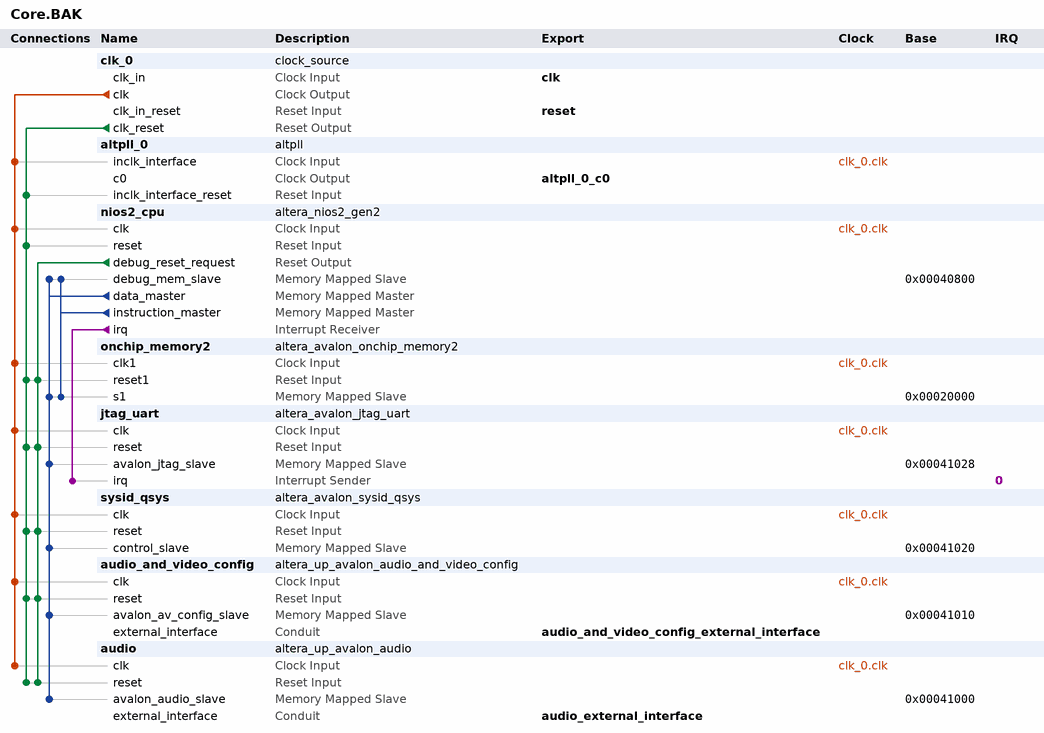
[diagram p0: system contents]
# Platform Designer (Qsys) system Core.BAK, Cyclone IV E EP4CE115F29C7
# Parameters at their usual value, and those the tool derives, are not listed.
package require -exact qsys 15.0
create_system Core.BAK
set_project_property DEVICE_FAMILY {Cyclone IV E}
set_project_property DEVICE EP4CE115F29C7

add_instance clk_0 clock_source 15.0
set_instance_parameter_value clk_0 clockFrequency 50000000

add_instance altpll_0 altpll 15.0
set_instance_parameter_value altpll_0 CLK0_DIVIDE_BY 25
set_instance_parameter_value altpll_0 CLK0_MULTIPLY_BY 6
set_instance_parameter_value altpll_0 INCLK0_INPUT_FREQUENCY 20000
set_instance_parameter_value altpll_0 PORT_ARESET PORT_USED
set_instance_parameter_value altpll_0 PORT_LOCKED PORT_USED
set_instance_parameter_value altpll_0 PORT_clk1 PORT_UNUSED
set_instance_parameter_value altpll_0 PORT_clk2 PORT_UNUSED
set_instance_parameter_value altpll_0 PORT_clk3 PORT_UNUSED

add_instance nios2_cpu altera_nios2_gen2 15.0
set_instance_parameter_value nios2_cpu dcache_size 2048
set_instance_parameter_value nios2_cpu exceptionSlave onchip_memory2.s1
set_instance_parameter_value nios2_cpu icache_size 4096
set_instance_parameter_value nios2_cpu impl Fast
set_instance_parameter_value nios2_cpu resetSlave onchip_memory2.s1

add_instance onchip_memory2 altera_avalon_onchip_memory2 15.0
set_instance_parameter_value onchip_memory2 dataWidth 32
set_instance_parameter_value onchip_memory2 dualPort false
set_instance_parameter_value onchip_memory2 initMemContent true
set_instance_parameter_value onchip_memory2 initializationFileName onchip_mem.hex
set_instance_parameter_value onchip_memory2 memorySize 102400

add_instance jtag_uart altera_avalon_jtag_uart 15.0
set_instance_parameter_value jtag_uart simInteractiveOptions NO_INTERACTIVE_WINDOWS

add_instance sysid_qsys altera_avalon_sysid_qsys 15.0
set_instance_parameter_value sysid_qsys id 0

add_instance audio_and_video_config altera_up_avalon_audio_and_video_config 15.0
set_instance_parameter_value audio_and_video_config audio_in {Microphone to ADC}
set_instance_parameter_value audio_and_video_config bit_length 16
set_instance_parameter_value audio_and_video_config board DE2-115
set_instance_parameter_value audio_and_video_config line_in_bypass true
set_instance_parameter_value audio_and_video_config mic_bypass true
set_instance_parameter_value audio_and_video_config sampling_rate {48 kHz}

add_instance audio altera_up_avalon_audio 15.0
set_instance_parameter_value audio audio_in true
set_instance_parameter_value audio avalon_bus_type {Memory Mapped}
set_instance_parameter_value audio dw 16

# connections
add_connection clk_0.clk altpll_0.inclk_interface clock
add_connection clk_0.clk audio.clk clock
add_connection clk_0.clk audio_and_video_config.clk clock
add_connection clk_0.clk jtag_uart.clk clock
add_connection clk_0.clk nios2_cpu.clk clock
add_connection clk_0.clk onchip_memory2.clk1 clock
add_connection clk_0.clk sysid_qsys.clk clock
add_connection clk_0.clk_reset altpll_0.inclk_interface_reset reset
add_connection clk_0.clk_reset audio.reset reset
add_connection clk_0.clk_reset audio_and_video_config.reset reset
add_connection clk_0.clk_reset jtag_uart.reset reset
add_connection clk_0.clk_reset nios2_cpu.reset reset
add_connection clk_0.clk_reset onchip_memory2.reset1 reset
add_connection clk_0.clk_reset sysid_qsys.reset reset
add_connection nios2_cpu.debug_reset_request audio.reset reset
add_connection nios2_cpu.debug_reset_request audio_and_video_config.reset reset
add_connection nios2_cpu.debug_reset_request jtag_uart.reset reset
add_connection nios2_cpu.debug_reset_request onchip_memory2.reset1 reset
add_connection nios2_cpu.debug_reset_request sysid_qsys.reset reset
add_connection nios2_cpu.data_master audio.avalon_audio_slave avalon
set_connection_parameter_value nios2_cpu.data_master/audio.avalon_audio_slave baseAddress 0x00041000
add_connection nios2_cpu.data_master audio_and_video_config.avalon_av_config_slave avalon
set_connection_parameter_value nios2_cpu.data_master/audio_and_video_config.avalon_av_config_slave baseAddress 0x00041010
add_connection nios2_cpu.data_master jtag_uart.avalon_jtag_slave avalon
set_connection_parameter_value nios2_cpu.data_master/jtag_uart.avalon_jtag_slave baseAddress 0x00041028
add_connection nios2_cpu.data_master nios2_cpu.debug_mem_slave avalon
set_connection_parameter_value nios2_cpu.data_master/nios2_cpu.debug_mem_slave baseAddress 0x00040800
add_connection nios2_cpu.data_master onchip_memory2.s1 avalon
set_connection_parameter_value nios2_cpu.data_master/onchip_memory2.s1 baseAddress 0x00020000
add_connection nios2_cpu.data_master sysid_qsys.control_slave avalon
set_connection_parameter_value nios2_cpu.data_master/sysid_qsys.control_slave baseAddress 0x00041020
add_connection nios2_cpu.instruction_master nios2_cpu.debug_mem_slave avalon
set_connection_parameter_value nios2_cpu.instruction_master/nios2_cpu.debug_mem_slave baseAddress 0x00040800
add_connection nios2_cpu.instruction_master onchip_memory2.s1 avalon
set_connection_parameter_value nios2_cpu.instruction_master/onchip_memory2.s1 baseAddress 0x00020000
add_connection nios2_cpu.irq jtag_uart.irq interrupt
set_connection_parameter_value nios2_cpu.irq/jtag_uart.irq irqNumber 0

# exported interfaces
add_interface altpll_0_c0 clock source
set_interface_property altpll_0_c0 EXPORT_OF altpll_0.c0
add_interface audio_and_video_config_external_interface conduit end
set_interface_property audio_and_video_config_external_interface EXPORT_OF audio_and_video_config.external_interface
add_interface audio_external_interface conduit end
set_interface_property audio_external_interface EXPORT_OF audio.external_interface
add_interface clk clock sink
set_interface_property clk EXPORT_OF clk_0.clk_in
add_interface reset reset sink
set_interface_property reset EXPORT_OF clk_0.clk_in_reset

set_interconnect_requirement {$system} qsys_mm.clockCrossingAdapter HANDSHAKE
set_interconnect_requirement {$system} qsys_mm.enableEccProtection FALSE
set_interconnect_requirement {$system} qsys_mm.insertDefaultSlave FALSE
set_interconnect_requirement {$system} qsys_mm.maxAdditionalLatency 1

save_system Core.BAK.qsys
